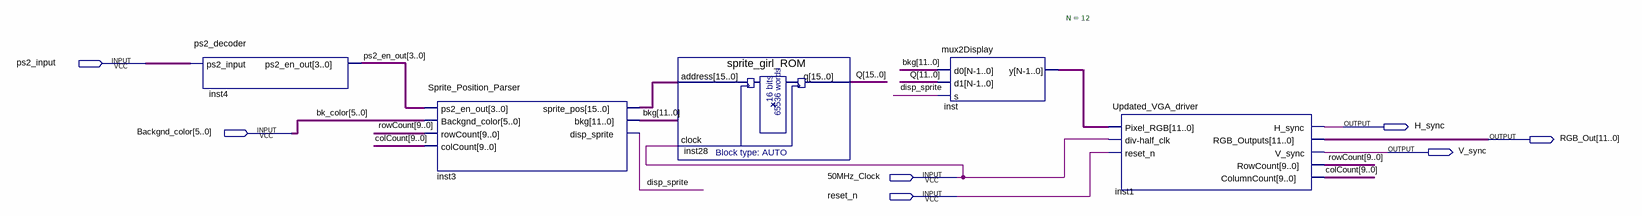
[diagram p0: schematic sheet]
// Quartus schematic Toplevel_Block_Diagram.bdf as structural Verilog: 5 symbols, 7 pins
module Toplevel_Block_Diagram (
  input  ps2_input,
  input  [5:0] Backgnd_color,
  input  \50MHz_Clock ,
  input  reset_n,
  output H_sync,
  output [11:0] RGB_Out,
  output V_sync
);

  wire disp_sprite;
  wire [3:0] ps2_en_out;
  wire [9:0] colCount, rowCount;
  wire [11:0] bkg, inst_y;
  wire [15:0] inst3_sprite_pos, Q;

  ps2_decoder inst4 (.ps2_input(ps2_input), .ps2_en_out(ps2_en_out));
  Sprite_Position_Parser inst3 (
    .Backgnd_color(Backgnd_color), .ps2_en_out(ps2_en_out), .rowCount(rowCount), .colCount(colCount),
    .bkg(bkg), .sprite_pos(inst3_sprite_pos), .disp_sprite(disp_sprite));
  sprite_girl_ROM inst28 (.address(inst3_sprite_pos), .clock(\50MHz_Clock ), .q(Q));
  mux2Display #(.N(12)) inst (.d0(bkg), .d1(Q[11:0]), .s(disp_sprite), .y(inst_y));
  Updated_VGA_driver inst1 (
    .Pixel_RGB(inst_y), .reset_n(reset_n), .\div-half_clk (\50MHz_Clock ), .H_sync(H_sync),
    .RGB_Outputs(RGB_Out), .V_sync(V_sync), .RowCount(rowCount), .ColumnCount(colCount));

  // Other names for the same wires on the sheet: bk_color[5:0] = Backgnd_color
endmodule
